# EAGLE design ns_V2 (EAGLE 5.09)
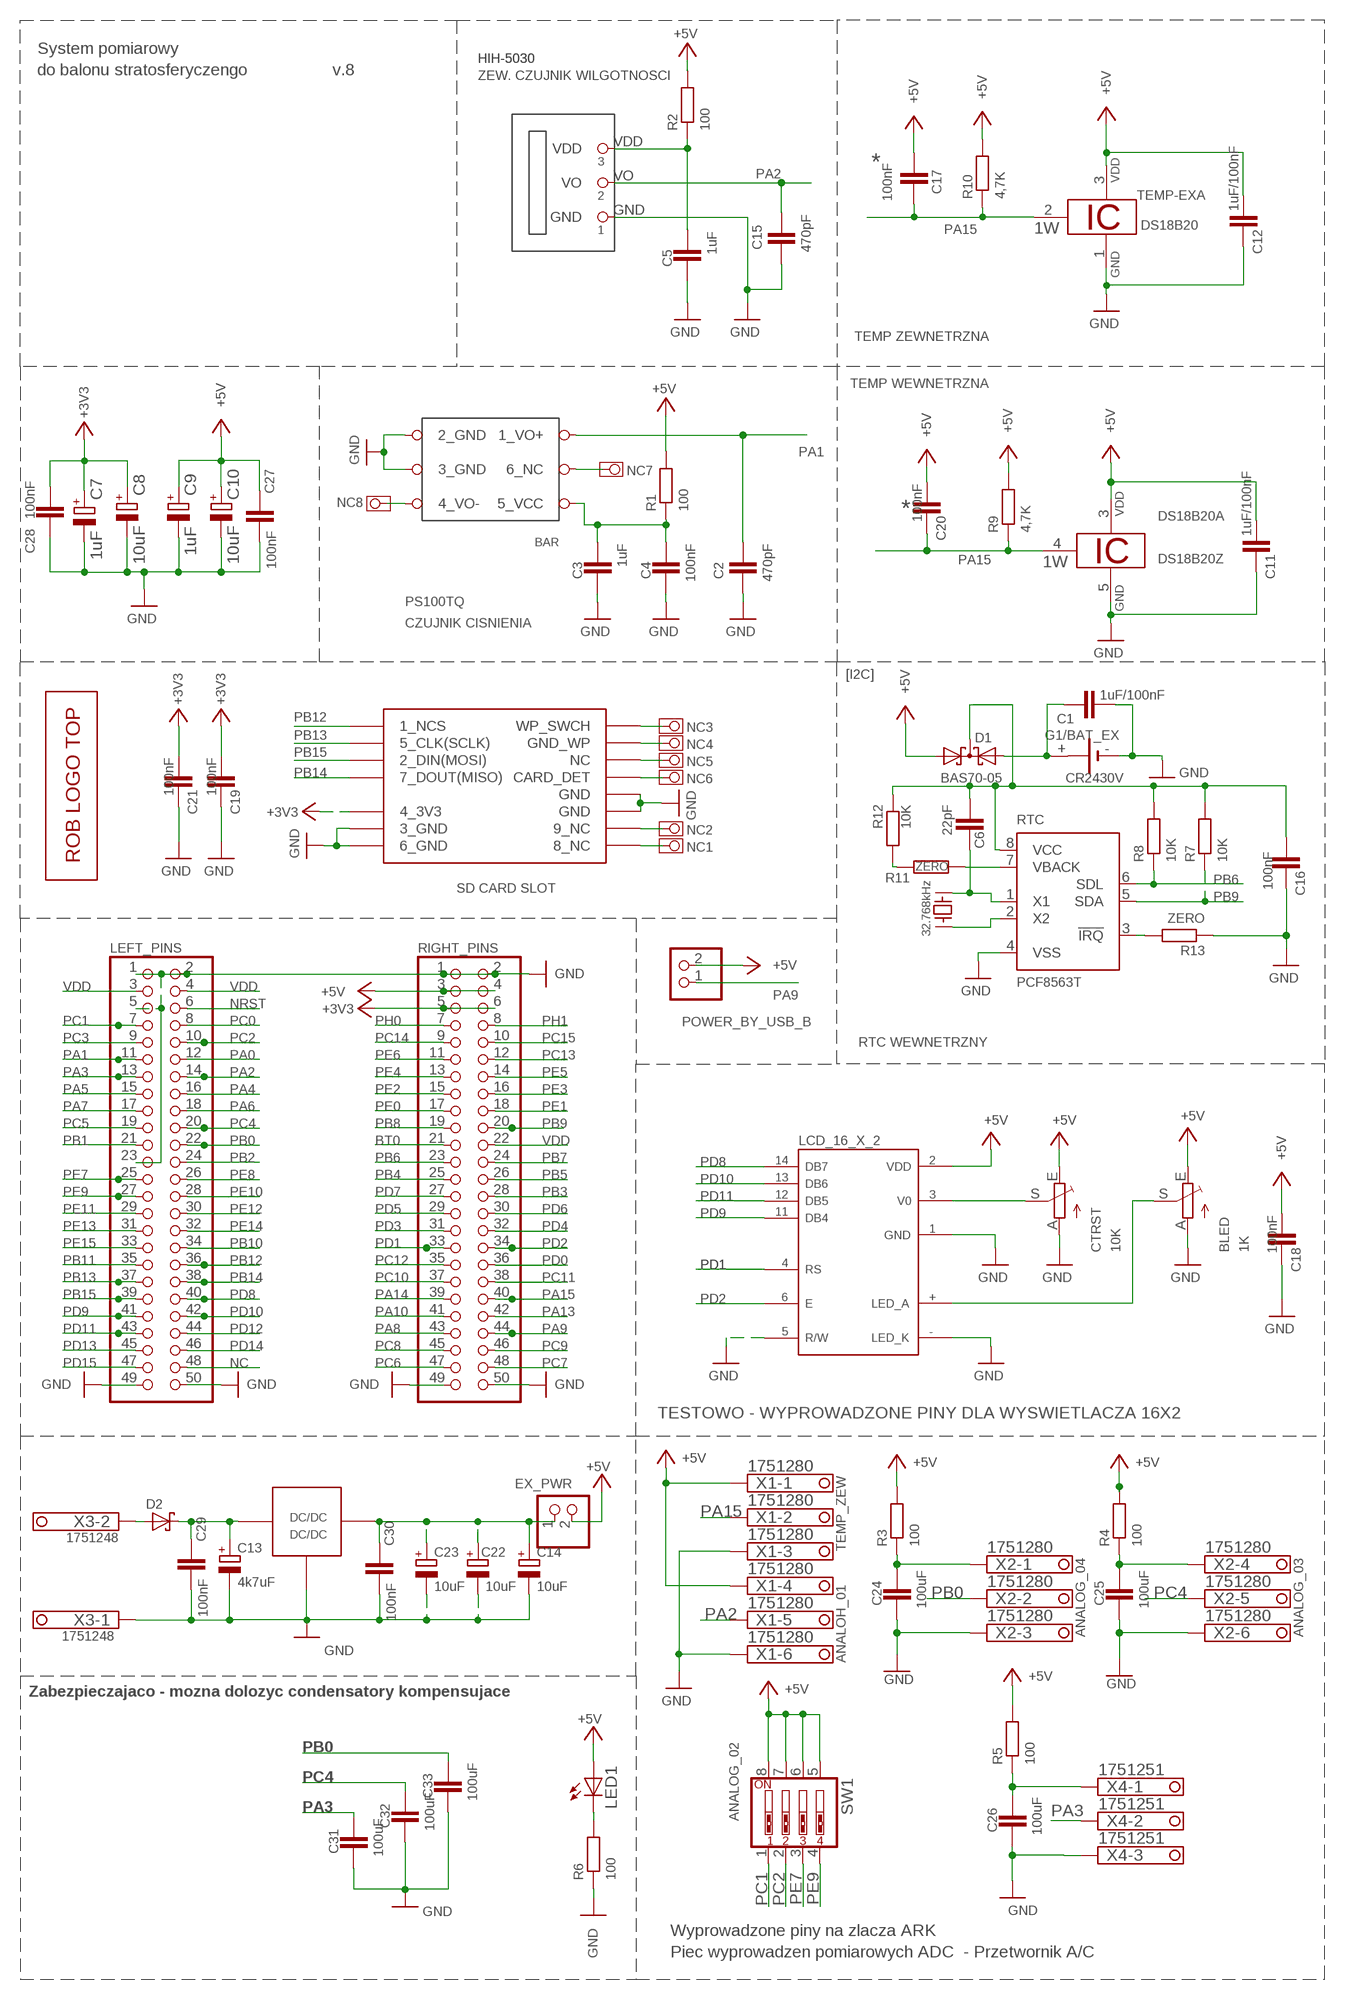
[diagram p0: schematic, sheet 1]

## Parts
BLED  1K  TRIM_EU-B25P  [B25P]
C1  1uF/100nF  C-EUC1206K  [C1206K]
C2  470pF  C-EUC1206  [C1206]
C3  1uF  C-EUC1206  [C1206]
C4  100nF  C-EUC1206  [C1206]
C5  1uF  C-EUC1206  [C1206]
C6  22pF  C-EUC1206  [C1206]
C7  1uF  CPOL-EU153CLV-0505  [153CLV-0505]
C8  10uF  CPOL-EU153CLV-0505  [153CLV-0505]
C9  1uF  CPOL-EU153CLV-0505  [153CLV-0505]
C10  10uF  CPOL-EU153CLV-0505  [153CLV-0505]
C11  1uF/100nF  C-EUC1206  [C1206]
C12  1uF/100nF  C-EUC1206  [C1206]
C13  4k7uF  CPOL-EU153CLV-0505  [153CLV-0505]
C14  10uF  CPOL-EU153CLV-0505  [153CLV-0505]
C15  470pF  C-EUC1206  [C1206]
C16  100nF  C-EUC1206  [C1206]
C17  100nF  C-EUC1206  [C1206]
C18  100nF  C-EUC1206  [C1206]
C19  100nF  C-EUC1206  [C1206]
C20  100nF  C-EUC1206  [C1206]
C21  100nF  C-EUC1206  [C1206]
C22  10uF  CPOL-EU153CLV-0505  [153CLV-0505]
C23  10uF  CPOL-EU153CLV-0505  [153CLV-0505]
C24  100uF  C-EUC1206  [C1206]
C25  100uF  C-EUC1206  [C1206]
C26  100uF  C-EUC1206  [C1206]
C27  100nF  C-EUC1206  [C1206]
C28  100nF  C-EUC1206  [C1206]
C29  100nF  C-EUC1206  [C1206]
C30  100nF  C-EUC1206  [C1206]
C31  100uF  C-EUC1206  [C1206]
C32  100uF  C-EUC1206  [C1206]
C33  100uF  C-EUC1206  [C1206]
CTRST  10K  TRIM_EU-B25P  [B25P]
D1  BAS70-05  [SOT23]
D2  MBRS130LT3  [SMB]
DS18B20  DS18B20Z  [SO08]
EX_PWR  PINHD-1X2  [1X02]
G1/BAT_EX  CR2430V  [CR2430V]
LCD_16_X_2  PYC0802A  [PYC0802A-ONLY-PINS]
LED1  LEDCHIPLED_1206  [CHIPLED_1206]
LEFT_PINS  PINHD-2X25  [2X25]
NC1  SMD_1X1  [SMD_1X1]
NC2  SMD_1X1  [SMD_1X1]
NC3  SMD_1X1  [SMD_1X1]
NC4  SMD_1X1  [SMD_1X1]
NC5  SMD_1X1  [SMD_1X1]
NC6  SMD_1X1  [SMD_1X1]
NC7  SMD_1X1  [SMD_1X1]
NC8  SMD_1X1  [SMD_1X1]
POWER_BY_USB_B  PINHD-1X2  [1X02]
R1  100  R-EU_R1206  [R1206]
R2  100  R-EU_R1206  [R1206]
R3  100  R-EU_R1206  [R1206]
R4  100  R-EU_R1206  [R1206]
R5  100  R-EU_R1206  [R1206]
R6  100  R-EU_R1206  [R1206]
R7  10K  R-EU_R1206  [R1206]
R8  10K  R-EU_R1206  [R1206]
R9  4,7K  R-EU_R1206  [R1206]
R10  4,7K  R-EU_R1206  [R1206]
R11  ZERO  R-EU_R1206  [R1206]
R12  10K  R-EU_R1206  [R1206]
R13  ZERO  R-EU_R1206  [R1206]
RIGHT_PINS  PINHD-2X25  [2X25]
RTC  PCF8563T  X1205S8  [SO-08]
SW1  SW_DIP-4  [EDG-04]
TEMP-EX  DS18B20  [TO92-]
U$1  MMC  [MMC_SOCKET]
U$2  XTAL-SMD-MC-146  [XTAL-SMD-MC-146]
U$3  PS100TQ  [PS100TQ]
U$4  HIH5030-CZUJ-WILG  [HIH-5030-CZUJ-WILG]
U$6  PRZETW-RECOM-R785  [PRZETW-RECOM-R785]
U$7  ROB-LOGO  [ROB-LOGO-TOP]
X1  1751280  [1751280]
X2  1751280  [1751280]
X3  1751248  [1751248]
X4  1751251  [1751251]

## Nets
5_WEW_PS100: C3.2 C4.2 R1.1 U$3.VCC(5_VCC)
9V: D2.A X3.2
9V_D: C13.+ C29.2 D2.C U$6.DC_IN
32_7_X1: C6.1 RTC.1(X1) U$2.P$3
32_7_X2: RTC.2(X2) U$2.P$1
+3V3: C7.+ C8.+ C19.2 C21.2 C28.2 RIGHT_PINS.5 RIGHT_PINS.6 U$1.4_3V3
+5_RTC: C6.2 C16.2 D1.3(C) R7.2 R8.2 R12.2 RTC.8(VCC)
+5V: BLED.E C9.+ C10.+ C11.2 C12.2 C17.2 C18.2 C20.2 C27.2 CTRST.E D1.1(A1) DS18B20.3 EX_PWR.2 LCD_16_X_2.2 LED1.A POWER_BY_USB_B.2 R1.2 R2.2 R3.2 R4.2 R5.2 R9.2 R10.2 RIGHT_PINS.3 RIGHT_PINS.4 SW1.5 SW1.6 SW1.7 SW1.8 TEMP-EX.3 X1.1 X1.4
BT0: RIGHT_PINS.21
GND: BLED.A C1.2 C2.1 C3.1 C4.1 C5.1 C7.- C8.- C9.- C10.- C11.1 C12.1 C13.- C14.- C15.1 C16.1 C18.1 C19.1 C21.1 C22.- C23.- C24.1 C25.1 C26.1 C27.1 C28.1 C29.1 C30.1 C31.1 C32.1 C33.1 CTRST.A DS18B20.5 G1/BAT_EX.- LCD_16_X_2.1 LCD_16_X_2.5 LCD_16_X_2.LED_K LEFT_PINS.1 LEFT_PINS.2 LEFT_PINS.5 LEFT_PINS.23 LEFT_PINS.49 LEFT_PINS.50 R6.1 R13.1 RIGHT_PINS.1 RIGHT_PINS.2 RIGHT_PINS.49 RIGHT_PINS.50 RTC.4(VSS) TEMP-EX.1 U$1.3_GND@1(3_GND) U$1.6_GND@2(6_GND) U$1.GND@3(GND) U$1.GND@4(GND) U$3.GND1(2_GND) U$3.GND2(3_GND) U$4.GND U$6.DC_GND X1.3 X1.6 X2.3 X2.6 X3.1 X4.3
LCD_LED_A: BLED.S LCD_16_X_2.LED_A
LCD_V0: CTRST.S LCD_16_X_2.3
N$1: NC7.P$1 U$3.NC(6_NC)
N$2: NC3.P$1 U$1.WRITE_PROTECTION_SWITCH(WP_SWCH)
N$3: NC8.P$1 U$3.V0-(4_VO-)
N$4: NC4.P$1 U$1.GND@WP(GND_WP)
N$6: NC5.P$1 U$1.NC@3(NC)
N$7: NC6.P$1 U$1.CARD_DETECTION(CARD_DET)
N$8: NC1.P$1 U$1.8_NC@2(8_NC)
N$9: NC2.P$1 U$1.9_NC@1(9_NC)
N$11: R11.1 RTC.7(VBACK)
N$12: C1.1 D1.2(A2) G1/BAT_EX.+
N$13: C5.2 R2.1 U$4.VDD
N$15: C24.2 R3.1 X2.1
N$16: C25.2 R4.1 X2.4
N$17: LED1.C R6.2
N$18: C26.2 R5.1 X4.1
N$19: R11.2 R12.1
N$28: R13.2 RTC.3(!IRQ)
NC: LEFT_PINS.48
NRST: LEFT_PINS.6
PA0: LEFT_PINS.12
PA1: C2.2 LEFT_PINS.11 U$3.VO+(1_VO+)
PA2: C15.2 LEFT_PINS.14 U$4.VO X1.5
PA3: C31.2 LEFT_PINS.13 X4.2
PA4: LEFT_PINS.16
PA5: LEFT_PINS.15
PA6: LEFT_PINS.18
PA7: LEFT_PINS.17
PA8: RIGHT_PINS.43
PA9: POWER_BY_USB_B.1 RIGHT_PINS.44
PA10: RIGHT_PINS.41
PA13: RIGHT_PINS.42
PA14: RIGHT_PINS.39
PA15: C17.1 C20.1 DS18B20.4 R9.1 R10.1 RIGHT_PINS.40 TEMP-EX.2 X1.2
PB0: C33.2 LEFT_PINS.22 X2.2
PB1: LEFT_PINS.21
PB2: LEFT_PINS.24
PB3: RIGHT_PINS.28
PB4: RIGHT_PINS.25
PB5: RIGHT_PINS.26
PB6: R8.1 RIGHT_PINS.23 RTC.6(SDL)
PB7: RIGHT_PINS.24
PB8: RIGHT_PINS.19
PB9: R7.1 RIGHT_PINS.20 RTC.5(SDA)
PB10: LEFT_PINS.34
PB11: LEFT_PINS.35
PB12: LEFT_PINS.36 U$1.1_NCS
PB13: LEFT_PINS.37 U$1.5_CLK(SCLK)
PB14: LEFT_PINS.38 U$1.7_DOUT(MISO)
PB15: LEFT_PINS.39 U$1.2_DIN(MOSI)
PC0: LEFT_PINS.8
PC1: LEFT_PINS.7 SW1.1
PC2: LEFT_PINS.10 SW1.2
PC3: LEFT_PINS.9
PC4: C32.2 LEFT_PINS.20 X2.5
PC5: LEFT_PINS.19
PC6: RIGHT_PINS.47
PC7: RIGHT_PINS.48
PC8: RIGHT_PINS.45
PC9: RIGHT_PINS.46
PC10: RIGHT_PINS.37
PC11: RIGHT_PINS.38
PC12: RIGHT_PINS.35
PC13: RIGHT_PINS.12
PC14: RIGHT_PINS.9
PC15: RIGHT_PINS.10
PD0: RIGHT_PINS.36
PD1: LCD_16_X_2.4 RIGHT_PINS.33
PD2: LCD_16_X_2.6 RIGHT_PINS.34
PD3: RIGHT_PINS.31
PD4: RIGHT_PINS.32
PD5: RIGHT_PINS.29
PD6: RIGHT_PINS.30
PD7: RIGHT_PINS.27
PD8: LCD_16_X_2.14 LEFT_PINS.40
PD9: LCD_16_X_2.11 LEFT_PINS.41
PD10: LCD_16_X_2.13 LEFT_PINS.42
PD11: LCD_16_X_2.12 LEFT_PINS.43
PD12: LEFT_PINS.44
PD13: LEFT_PINS.45
PD14: LEFT_PINS.46
PD15: LEFT_PINS.47
PE0: RIGHT_PINS.17
PE1: RIGHT_PINS.18
PE2: RIGHT_PINS.15
PE3: RIGHT_PINS.16
PE4: RIGHT_PINS.13
PE5: RIGHT_PINS.14
PE6: RIGHT_PINS.11
PE7: LEFT_PINS.25 SW1.3
PE8: LEFT_PINS.26
PE9: LEFT_PINS.27 SW1.4
PE10: LEFT_PINS.28
PE11: LEFT_PINS.29
PE12: LEFT_PINS.30
PE13: LEFT_PINS.31
PE14: LEFT_PINS.32
PE15: LEFT_PINS.33
PH0: RIGHT_PINS.7
PH1: RIGHT_PINS.8
PLUS_5: C14.+ C22.+ C23.+ C30.2 EX_PWR.1 U$6.DC_OUT
VDD: LEFT_PINS.3 LEFT_PINS.4 RIGHT_PINS.22
Unconnected: G1/BAT_EX.+@1(+)

## Notes on the sheet
- System pomiarowy
- HIH-5030 | HIH-5030
- do balonu stratosferyczengo | v.8
- ZEW. CZUJNIK WILGOTNOSCI
- *
- TEMP ZEWNETRZNA
- TEMP WEWNETRZNA
- *
- PS100TQ
- CZUJNIK CISNIENIA
- [I2C]
- SD CARD SLOT
- RTC WEWNETRZNY
- TESTOWO - WYPROWADZONE PINY DLA WYSWIETLACZA 16X2
- TEMP_ZEW
- ANALOG_04 | ANALOG_03
- ANALOH_01
- Zabezpieczajaco - mozna dolozyc condensatory kompensujace
- ANALOG_02
- Wyprowadzone piny na zlacza ARK
- Piec wyprowadzen pomiarowych ADC  - Przetwornik A/C

## Library data of the parts
BLED CTRST = pot:TRIM_EU-: POTENTIOMETER
C1-C6 C11 C12 C15-C21 C24-C33 = rcl:C-EU: CAPACITOR, European symbol
C7-C10 C13 C14 C22 C23 = rcl:CPOL-EU: POLARIZED CAPACITOR, European symbol
D1 = diode:BAS70-05: Silicon Schottky Diodes General-purpose diode for high-speed switching
D2 = diode:MBRS130LT3: Schottky Power Rectifier Source: http://www.onsemi.com/pub/Collateral/MBRS130LT3-D.PDF
DS18B20 TEMP-EX = ds18b20:DS18B20: Programmable Resolution Digital Thermometer This chip provides a onewire thermosensor with approx. 0.5°C accuracy. A programmable over/undertemperure alarm is available. The precision can be set from 9..12 bits. Notes: Vdd must be applied for accurate measurements at low temperatures, as the parasite power circuit otherwise heats the sensor. If parasite power is used, Vdd has to be connected to GND. The DS1822 is a low-cost thermometer chip, the DS18S20 is similar to the DS18B20, but with 9 Bit precision only. Author: Jan Kandziora <jjj@gmx.de>
EX_PWR POWER_BY_USB_B = pinhead:PINHD-1X2: PIN HEADER
G1/BAT_EX = battery:CR2430V: LI BATTERY Varta
LCD_16_X_2 = PYC0802:PYC0802A
LED1 = led:LED: LED OSRAM: - CHIPLED LG R971, LG N971, LY N971, LG Q971, LY Q971, LO R971, LY R971 LH N974, LH R974 LS Q976, LO Q976, LY Q976 LO Q996 - Hyper CHIPLED LW Q18S LB Q993, LB Q99A, LB R99A - SideLED LS A670, LO A670, LY A670, LG A670, LP A670 LB A673, LV A673, LT A673, LW A673 LH A674 LY A675 LS A676, LA A676, LO A676, LY A676, LW A676 LS A679, LY A679, LG A679 - Hyper Micro SIDELED® LS Y876, LA Y876, LO Y876, LY Y876 LT Y87S - SmartLED LW L88C, LW L88S LB L89C, LB L89S, LG L890 LS L89K, LO L89K, LY L89K LS L896, LA L896, LO L896, LY L896 - TOPLED LS T670, LO T670, LY T670, LG T670, LP T670 LSG T670, LSP T670, LSY T670, LOP T670, LYG T670 LG T671, LOG T671, LSG T671 LB T673, LV T673, LT T673, LW T673 LH T674 LS T676, LA T676, LO T676, LY T676, LB T676, LH T676, LSB T676, LW T676 LB T67C, LV T67C, LT T67C, LS T67K, LO T67K, LY T67K, LW E67C LS E67B, LA E67B, LO E67B, LY E67B, LB E67C, LV E67C, LT E67C LW T67C LS T679, LY T679, LG T679 LS T770, LO T770, LY T770, LG T770, LP T770 LB T773, LV T773, LT T773, LW T773 LH T774 LS E675, LA E675, LY E675, LS T675 LS T776, LA T776, LO T776, LY T776, LB T776 LHGB T686 LT T68C, LB T68C - Hyper Mini TOPLED® LB M676 - Mini TOPLED Santana® LG M470 LS M47K, LO M47K, LY M47K Source: http://www.osram.convergy.de LUXEON: - LUMILED® LXK2-PW12-R00, LXK2-PW12-S00, LXK2-PW14-U00, LXK2-PW14-V00 LXK2-PM12-R00, LXK2-PM12-S00, LXK2-PM14-U00 LXK2-PE12-Q00, LXK2-PE12-R00, LXK2-PE12-S00, LXK2-PE14-T00, LXK2-PE14-U00 LXK2-PB12-K00, LXK2-PB12-L00, LXK2-PB12-M00, LXK2-PB14-N00, LXK2-PB14-P00, LXK2-PB14-Q00 LXK2-PR12-L00, LXK2-PR12-M00, LXK2-PR14-Q00, LXK2-PR14-R00 LXK2-PD12-Q00, LXK2-PD12-R00, LXK2-PD12-S00 LXK2-PH12-R00, LXK2-PH12-S00 LXK2-PL12-P00, LXK2-PL12-Q00, LXK2-PL12-R00 Source: www.luxeon.com KINGBRIGHT: KA-3528ASYC Source: www.kingbright.com
LEFT_PINS RIGHT_PINS = pinhead:PINHD-2X25: PIN HEADER
NC1-NC8 = pinhead:SMD_1X1
R1-R13 = rcl:R-EU_: RESISTOR, European symbol
RTC = xicor:X1205*: 2-Wire RTC Real Time Clock/Calendar
SW1 = special:SW_DIP-4: DIP SWITCH
U$1 = SD:MMC
U$2 = rob:XTAL-SMD-MC-146
U$3 = rob:PS100TQ
U$4 = rob:HIH5030-CZUJ-WILG
U$6 = rob:PRZETW-RECOM-R785
U$7 = rob:ROB-LOGO
X1 X2 = con-phoenix-350:1751280: MKDS 1/ 6-3,5 Printklemme Nennstrom: 10 A Bemessungsspannung: 160 V Raster: 3,5 mm Polzahl: 6 Montageart: Löten Anschlussart: Schraubanschluss Anschlussrichtung vom Leiter zur Platine: 0° Source: http://eshop.phoenixcontact.com .. 1751280.pdf
X3 = con-phoenix-350:1751248: MKDS 1/ 2-3,5 Printklemme Nennstrom: 10 A Bemessungsspannung: 160 V Raster: 3,5 mm Polzahl: 2 Montageart: Löten Anschlussart: Schraubanschluss Anschlussrichtung vom Leiter zur Platine: 0° Source: http://eshop.phoenixcontact.com .. 1751248.pdf
X4 = con-phoenix-350:1751251: MKDS 1/ 3-3,5 Printklemme Nennstrom: 10 A Bemessungsspannung: 160 V Raster: 3,5 mm Polzahl: 3 Montageart: Löten Anschlussart: Schraubanschluss Anschlussrichtung vom Leiter zur Platine: 0° Source: http://eshop.phoenixcontact.com .. 1751251.pdf

## Board
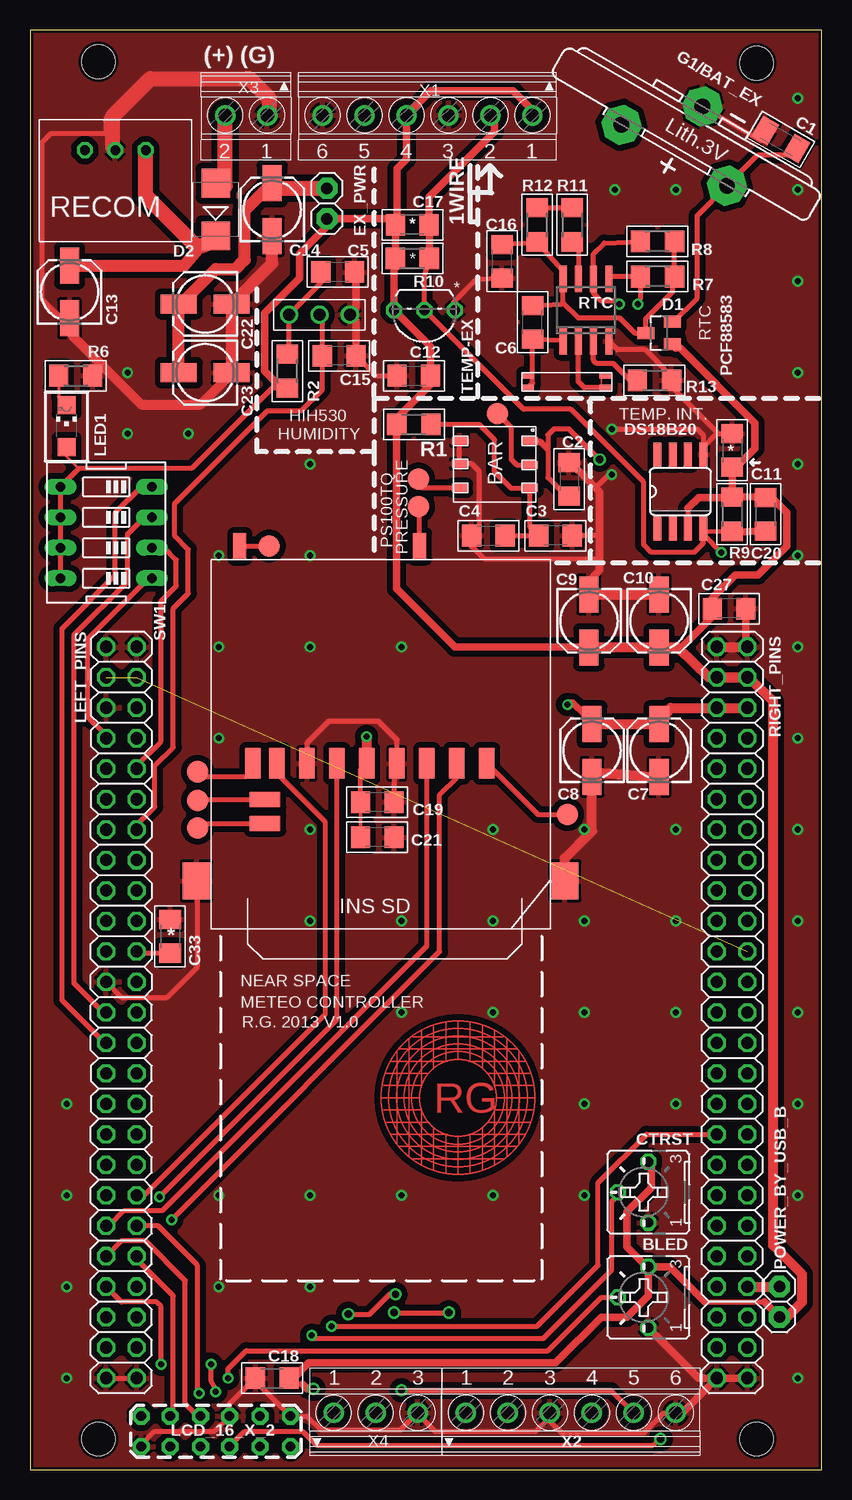
[diagram p1: board, top side]
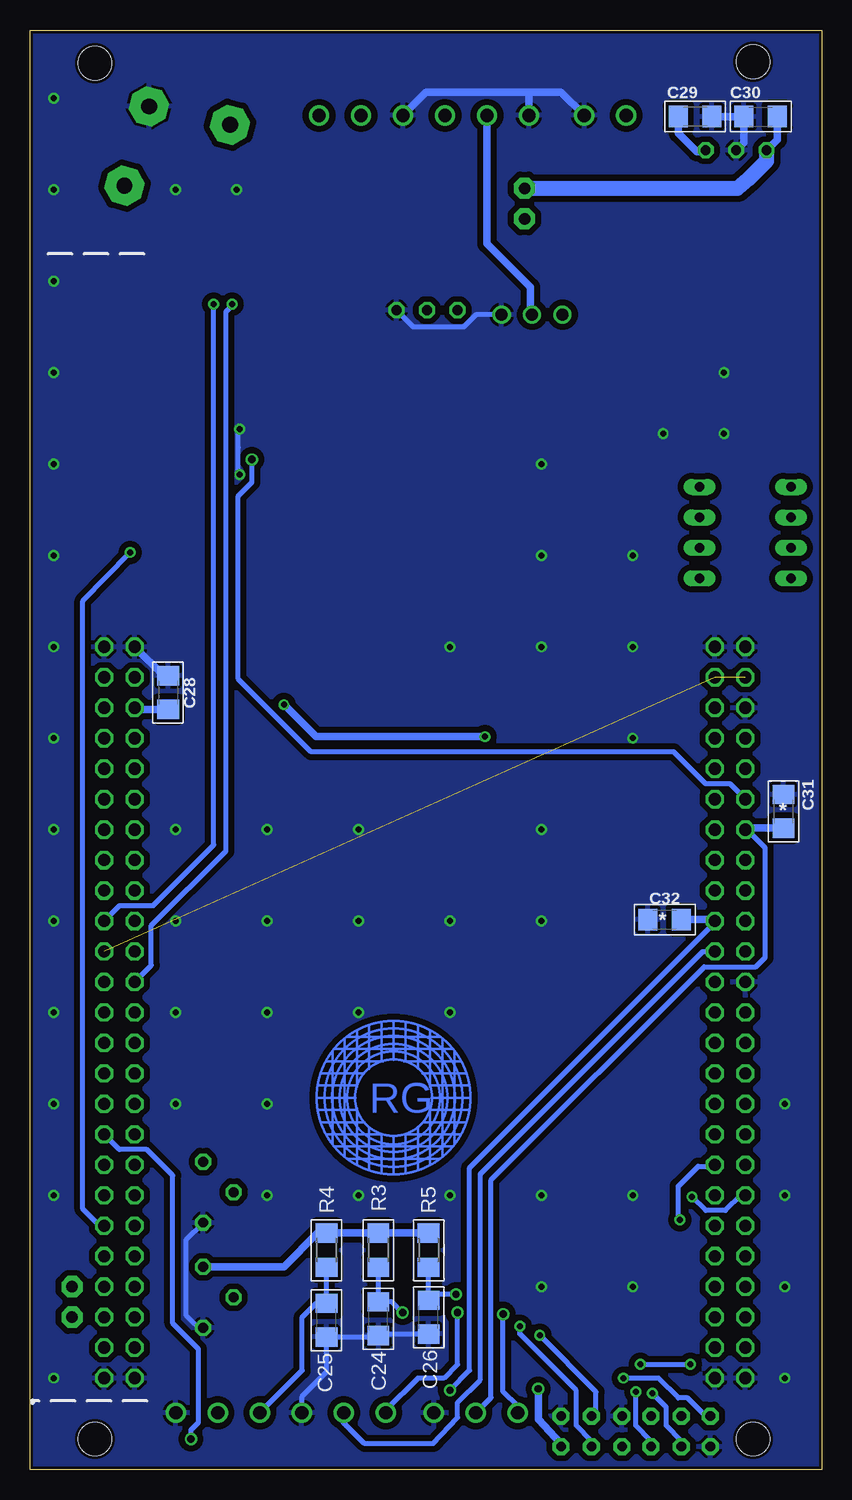
[diagram p2: board, bottom side, seen from below]

Size 66 x 120 mm. Coordinates in mm from the lower left corner, seen from the top.
Outline: 0,0 66,0 66,120 0,120 0,0
Copper layers (1*16): Top 0.035mm / dielectric 3mm / Bottom 0.035mm
Design rules "default *": minimum track width 10mil, minimum drill 24mil, track to track 20mil, track to pad 20mil, pad to pad 20mil, via to via 20mil, smd to smd 20mil, copper to edge 10mil, drill to drill 20mil, minimum pad ring 10mil, minimum via ring 8mil, stop-mask expansion 4mil, vias tented up to drill 0mil, thermal gap 10mil
Holes 2.8 mm at 5.71,117.35 60.58,117.22 60.58,2.54 5.71,2.54

### Footprints (pad centres in the part's own frame; a part is rotated, then mirrored left to right if it is on the bottom)
B25P = drill 0.813 octagon: A -2.54,0; E 2.54,0; S 0,2.54
C1206K = smd 1.5 x 2: 1 -1.5,0; 2 1.5,0
C1206 = smd 1.6 x 1.8: 1 -1.4,0; 2 1.4,0
153CLV-0505 = smd 3 x 1.6: + 2.2,0; - -2.2,0
SOT23 = smd 1 x 1.4: 1 -0.95,-1.1; 2 0.95,-1.1; 3 0,1.1
SMB = smd 2.4 x 2.4: A 2.2,0; C -2.2,0
SO08 = smd 0.66 x 2.032: 1 -1.905,-3.073; 2 -0.635,-3.073; 3 0.635,-3.073; 4 1.905,-3.073; 5 1.905,3.073; 6 0.635,3.073; 7 -0.635,3.073; 8 -1.905,3.073
1X02 = drill 0.965 pad 1.778 octagon: 1 -1.27,0; 2 1.27,0
CR2430V = drill 1.321 pad 3.15 octagon: + -2.54,-5.08; +@1 -2.54,5.08; - 2.159,0
PYC0802A-ONLY-PINS = drill 0.8 pad 1.422 octagon: 1 2.54,0; 2 0,0; 3 2.54,2.54; 4 0,2.54; 5 2.54,5.08; 6 0,5.08; 11 2.54,7.493; 12 0,7.493; 13 2.54,10.033; 14 0,10.033; LED_A 2.54,12.446; LED_K 0,12.446
CHIPLED_1206 = smd 1.5 x 1.5: A 0,-1.75; C 0,1.75
2X25 = drill 1.016 octagon: 1 -30.48,-1.27; 2 -30.48,1.27; 3 -27.94,-1.27; 4 -27.94,1.27; 5 -25.4,-1.27; 6 -25.4,1.27; 7 -22.86,-1.27; 8 -22.86,1.27; 9 -20.32,-1.27; 10 -20.32,1.27; 11 -17.78,-1.27; 12 -17.78,1.27; 13 -15.24,-1.27; 14 -15.24,1.27; 15 -12.7,-1.27; 16 -12.7,1.27; 17 -10.16,-1.27; 18 -10.16,1.27; 19 -7.62,-1.27; 20 -7.62,1.27; 21 -5.08,-1.27; 22 -5.08,1.27; 23 -2.54,-1.27; 24 -2.54,1.27; 25 0,-1.27; 26 0,1.27; 27 2.54,-1.27; 28 2.54,1.27; 29 5.08,-1.27; 30 5.08,1.27; 31 7.62,-1.27; 32 7.62,1.27; 33 10.16,-1.27; 34 10.16,1.27; 35 12.7,-1.27; 36 12.7,1.27; 37 15.24,-1.27; 38 15.24,1.27; 39 17.78,-1.27; 40 17.78,1.27; 41 20.32,-1.27; 42 20.32,1.27; 43 22.86,-1.27; 44 22.86,1.27; 45 25.4,-1.27; 46 25.4,1.27; 47 27.94,-1.27; 48 27.94,1.27; 49 30.48,-1.27; 50 30.48,1.27
SMD_1X1 = smd 1.778 x 1.778: P$1 0,0
R1206 = smd 1.6 x 1.803: 1 -1.422,0; 2 1.422,0
SO-08 = smd 0.6 x 2.2: 1 -1.905,-2.6; 2 -0.635,-2.6; 3 0.635,-2.6; 4 1.905,-2.6; 5 1.905,2.6; 6 0.635,2.6; 7 -0.635,2.6; 8 -1.905,2.6
EDG-04 = drill 0.813 long: 1 -3.81,-3.81; 2 -1.27,-3.81; 3 1.27,-3.81; 4 3.81,-3.81; 5 3.81,3.81; 6 1.27,3.81; 7 -1.27,3.81; 8 -3.81,3.81
TO92- = drill 0.813 octagon: 1 -2.54,0; 2 0,0; 3 2.54,0
MMC_SOCKET = smd 1.27 x 2.54: 1_NCS 7.27,-2.73; 2_DIN(MOSI) 4.77,-2.73; 3_GND@1 2.27,-2.73; 4_3V3 -0.23,-2.73; 5_CLK(SCLK) -2.73,-2.73; 6_GND@2 -5.23,-2.73; 7_DOUT(MISO) -7.73,-2.73; 8_NC@2 -9.73,-2.73; 9_NC@1 9.77,-2.73 | smd 1.067 x 2.184: CARD_DETECTION -10.83,15.37; NC@3 4.17,15.37 | smd 2.3 x 3.1: GND@3 -14.43,-12.53; GND@4 16.27,-12.53 | smd 2.54 x 1.27: GND@WP -8.73,-5.73; WRITE_PROTECTION_SWITCH -8.73,-7.73
XTAL-SMD-MC-146 = smd 1.016 x 0.508: P$1 0.508,1.27; P$2 0.508,0.254; P$3 6.985,1.27; P$4 6.985,0.254
PS100TQ = smd 1.27 x 0.66: GND1 0.5,5.1; GND2 0.5,3.2; NC 6.4,3.1; V0- 0.5,1.2; VCC 6.4,1.2; VO+ 6.4,5.1
HIH-5030-CZUJ-WILG = drill 1 pad 1.27 round: GND 1.27,0; VDD -3.81,0; VO -1.27,0
PRZETW-RECOM-R785 = drill 0.8 octagon: DC_GND 2.54,0; DC_IN 0,0; DC_OUT 5.08,0
1751280 = drill 1.1 pad 1.7 round: 1 -8.75,-0.1; 2 -5.25,-0.1; 3 -1.75,-0.1; 4 1.75,-0.1; 5 5.25,-0.1; 6 8.75,-0.1
1751248 = drill 1.1 pad 1.7 round: 1 -1.75,-0.1; 2 1.75,-0.1
1751251 = drill 1.1 pad 1.7 round: 1 -3.5,-0.1; 2 0,-0.1; 3 3.5,-0.1

### Placement (x,y rotation side)
BLED  51.56,14.35 90 top
C1  62.61,110.87 150 top
C2  44.96,82.55 270 top
C3  43.81,77.85 180 top
C4  38.23,77.85 0 top
C5  25.65,99.82 180 top
C6  41.91,95.63 90 top
C7  52.45,59.94 90 top
C8  46.86,59.94 90 top
C9  46.61,70.74 270 top
C10  52.45,70.74 270 top
C11  58.55,84.96 270 top
C12  32,91.19 0 top
C13  3.3,98.17 90 top
C14  20.19,105.03 90 top
C15  25.78,92.84 180 top
C16  39.37,100.71 90 top
C17  31.88,103.76 180 top
C18  20.19,7.62 0 top
C19  28.96,55.63 180 top
C20  61.34,79.63 90 top
C21  28.96,52.7 180 top
C22  14.61,97.16 180 top
C23  14.61,91.44 180 top
C24  36.96,12.57 90 bottom
C25  41.27,12.45 90 bottom
C26  32.77,12.7 90 bottom
C27  58.29,71.75 180 top
C28  54.48,64.77 270 bottom
C29  10.54,112.78 180 bottom
C30  5.08,112.78 0 bottom
C31  3.17,54.86 270 bottom
C32  13.08,45.85 0 bottom
C33  11.68,44.45 270 top
CTRST  51.56,23.11 90 top
D1  52.45,94.74 90 top
D2  15.49,105.03 90 top
DS18B20  54.23,81.53 0 top
EX_PWR  24.77,105.54 270 top
G1/BAT_EX  54.99,111.76 60 top
LCD_16_X_2  21.72,1.91 90 top
LED1  3.05,87 0 top
LEFT_PINS  7.62,38.1 270 top
NC1  13.97,58.17 0 top
NC2  44.83,54.61 0 top
NC3  13.97,53.47 0 top
NC4  13.97,55.75 0 top
NC5  32.38,80.26 0 top
NC6  19.94,76.96 0 top
NC7  38.99,88.01 0 top
NC8  32.38,82.55 0 top
POWER_BY_USB_B  62.48,13.97 270 top
R1  32,87.12 180 top
R2  21.46,91.57 270 top
R3  36.96,18.29 90 bottom
R4  41.27,18.29 90 bottom
R5  32.77,18.29 90 bottom
R6  3.81,91.19 180 top
R7  52.32,99.44 0 top
R8  52.32,102.36 0 top
R9  58.55,79.63 90 top
R10  31.88,100.97 180 top
R11  45.21,103.76 90 top
R12  42.29,103.76 270 top
R13  52.07,90.81 180 top
RIGHT_PINS  58.55,38.1 270 top
RTC  46.35,96.65 0 top
SW1  6.35,78.11 90 top
TEMP-EX  32.89,96.65 180 top
U$1  28.32,61.59 0 top
U$2  48.51,91.44 180 top
U$3  35.31,80.64 0 top
U$4  25.4,96.27 0 top
U$5  ROB-LOGO  [ROB-LOGO-TOP@1]  35.69,30.99 0 top
U$6  9.65,109.98 180 top
U$7  35.69,30.99 0 bottom
X1  33.15,112.78 180 top
X2  45.09,4.83 0 top
X3  18.03,112.78 180 top
X4  28.83,4.83 0 top

### Tracks (layer width: path | path; a pad name or v marks a point on that pad's centre or on a via)
5_WEW_PS100
  Top 0.406: R1.1 37.47,87.12 38.73,85.85 38.73,83.19 40.13,81.79 41.65,81.79 U$3.VCC 41.71,78.56 C3.2 C4.2
9V
  Top 1.27: X3.2 16.28,107 D2.A
9V_D
  Top 1.016: C13.+ 12.87,100.37 14.22,101.98
  Top 1.27: U$6.DC_IN 9.65,106.17 13.84,101.98 14.22,101.98 15.41,102.49 D2.C
  Bottom 0.61: C29.2 11.94,111.38 10.41,109.86 9.78,109.86 U$6.DC_IN
32_7_X1
  Top 0.406: RTC.1 44.37,94.13 C6.1 41.91,90.55 U$2.P$3
32_7_X2
  Top 0.406: RTC.2 45.72,90.68 46.23,90.17 U$2.P$1
+3V3  (via drill 0.5)
  Top 0.305: C21.2 C19.2
  Top 0.406: C19.2 27.58,58.36 U$1.4_3V3
  Top 0.61: 28.09,61.06 v28.07,61.09 | v44.83,63.75 44.83,63.88 45.21,63.88 45.34,63.75 46.1,63.16 C8.+
  Top 0.813: RIGHT_PINS.6 RIGHT_PINS.5 53.43,63.5 C7.+ C8.+ | U$1.4_3V3 28.09,61.06
  Bottom 0.61: v28.07,61.09 42.16,61.09 v44.83,63.75 | C28.2 57.15,63.37 RIGHT_PINS.5
+5_RTC
  Top 0.406: R8.2 R7.2 53.59,99.31 53.59,98.17 51.35,95.93 D1.3 50.42,94.74 49.15,96.01 45.72,96.01 44.45,97.28 | C16.2 41.91,102.21 R12.2 44.45,99.92 RTC.8 44.45,97.28 | C6.2 44.3,97.13 44.45,97.28
+5V  (via drill 0.6)
  Top 0.254: LED1.A 3.05,84.45 4.06,83.44
  Top 0.406: 58.55,80.9 R9.2 58.54,81.03 58.04,81.03 | 54.86,80.14 DS18B20.3 54.86,77.85 | C11.2 58.7,83.34 | 54.23,93.47 53.87,93.47 | BLED.E 51.69,16.89 | 52.45,68.83 52.7,68.83 | 29.97,104.27 C17.2 | SW1.8 SW1.7 SW1.6 SW1.5 4.06,83.44 13.46,83.44 20.17,90.14 R2.2 20.98,90.14 | 30.58,87.61 R1.2 | 33.53,90.55 33.53,91.06 C12.2 | 24.64,103.5 24.64,104.14 EX_PWR.2 | 21.97,7.62 C18.2 22.1,7.11 22.73,7.11 | 56.26,13.97 61.21,13.97
  Top 0.61: 58.55,80.9 C11.2 | 30.35,104.27 29.97,104.27 | 30.35,104.27 30.61,104.52 30.61,108.46 31.4,109.25 X1.4 33.46,114.94 40.26,114.94 41.9,113.3 X1.1 | 54.86,80.14 55.75,81.03 58.04,81.03 58.52,81.13 C20.2 61.72,81.15 63.12,79.76 63.12,76.96 60.71,74.55 58.8,74.55 56.89,72.64 C27.2 56.89,71.1 54.18,68.39 54.17,68.39 54.1,68.46 | 58.7,83.34 60.45,85.09 60.45,87.25 54.23,93.47 | 53.87,93.47 D1.1 | CTRST.E 51.82,25.4 51.82,23.5 49.78,21.46 49.78,18.54 51.69,16.64 51.69,16.89 53.34,16.89 56.26,13.97 | EX_PWR.2 30,104.27 C17.2 | 30.35,104.27 30.42,104.2 30.48,104.39 30.48,100.21 R10.2 30.35,99.7 TEMP-EX.3 33.4,93.6 C12.2 | 33.53,90.55 30.58,87.61 30.58,73.43 35.43,68.58 46.57,68.58 C9.+ | 20.98,90.14 19.56,91.57 19.56,96.39 22.48,99.31 22.48,101.35 24.64,103.5 | 21.97,7.62 23.24,8.89 43.81,8.89 47.62,12.7 49.78,12.7 51.56,14.48 BLED.E | v23.62,6.73 23.11,6.73 22.73,7.11 | 61.21,13.97 POWER_BY_USB_B.2
  Top 0.813: C10.+ C9.+ | RIGHT_PINS.3 RIGHT_PINS.4 | RIGHT_PINS.3 56.6,66.04 54.1,68.46 53.98,68.58 53.93,68.54 C10.+ | C10.+ 52.45,68.83 | RIGHT_PINS.3 59.94,66.04 61.98,64.01 61.98,18.67 64.39,16.26 64.39,13.97 63.12,12.7 POWER_BY_USB_B.2
  Bottom 0.406: 42.01,19.71 R4.2 | LCD_16_X_2.2 21.72,2.16
  Bottom 0.61: R5.2 R3.2 R4.2 | 42.01,19.71 44.83,16.89 BLED.E | 21.72,2.16 23.62,4.19 v23.62,6.73
GND  (via drill 0.5)
  Top 0.406: 57.4,86.36 57.28,86.36 56.13,85.22 DS18B20.5 56.13,86.23 55.63,86.74 v48.51,86.74 | 57.4,86.36 58.4,86.36 C11.1 | G1/BAT_EX.- 60.96,110.74 C1.2 | C16.1 37.23,99.21 35.31,97.28 35.31,96.77 TEMP-EX.1 | 57.4,86.36 53.49,90.27 R13.1 53.49,91.16 51.31,93.34 48.96,93.34 RTC.4 | C19.1 30.46,58.73 U$1.3_GND@1 30.61,58.88 30.61,60.83 29.08,62.36 24.89,62.36 23.09,60.56 U$1.6_GND@2 | 46.23,82.8 45.97,83.06 45.96,83.05 | U$1.GND@3 13.97,48.99 13.97,41.91 11.43,39.37 7.62,39.37 LEFT_PINS.23 | 9.91,115.82 9.65,115.82 6.86,113.03 6.73,113.03 6.35,112.65 6.35,111.51 6.48,111.38 1.78,111.38 1.02,110.62 1.02,97.54 3.17,95.38 | C3.1 47.24,77.85 47.5,77.6 | 35.58,85.75 U$3.GND1 U$3.GND2 36.8,83.84 37.47,83.19 37.47,78.49 C4.1 36.7,77.73 36.7,77.09 37.85,75.95 47.37,75.95 47.5,75.82 | C15.1 28.83,91.19 C12.1 | C2.1 45.21,83.95 47.24,81.92 | 47.24,81.92 47.5,81.66 47.5,75.82 | 46.23,73.66 47.5,74.93 47.5,75.82 | v48.5,82.94 48.27,82.94 47.24,81.92 | X4.3 32.33,4.77 | 54.38,4.73 X2.6 | 57.15,7.62 55.75,7.62 | 57.15,7.62 57.4,7.87 | 57.15,7.62 54.23,4.7 52.83,4.7 51.18,3.05 44.32,3.05 43.18,4.19 | LCD_16_X_2.LED_K 9.27,2.03 10.41,3.17 15.37,3.17 LCD_16_X_2.5 16.64,5.46 18.69,7.52 C18.1 18.69,7.47 LCD_16_X_2.1 23.11,4.45 24.26,3.3 30.91,3.3 X4.3 | LEFT_PINS.49 LEFT_PINS.50 | 43.18,4.19 43.18,4.57 X2.3 | X4.3 32.33,4.63 33.78,3.17 42.16,3.17 43.18,4.19
  Top 0.61: C5.1 27.18,99.8 27.18,96.77 U$4.GND 27.18,95.75 C15.1 | 46.48,72.9 46.48,73.91 47.5,74.93 47.5,77.6 47.5,81.51 45.96,83.05 C2.1 | RIGHT_PINS.49 54.38,4.73 | RIGHT_PINS.49 RIGHT_PINS.50 | RIGHT_PINS.49 55.75,7.62 BLED.A | C27.1 59.69,68.7 RIGHT_PINS.2
  Top 0.813: C7.- 47.24,58.12 C8.- 46.86,53.21 44.59,50.94 U$1.GND@4 | C10.- C9.- 46.4,72.94 46.35,72.9 46.48,72.9 | RIGHT_PINS.1 RIGHT_PINS.2 | 20.19,100.54 20.15,100.54 16.76,97.16 16.76,91.06 16.51,91.06 14.22,88.77 9.27,88.77 3.68,94.36 3.17,95.38 3.17,95.84 C13.-
  Top 1.016: C23.- C22.- 20.19,100.54 C14.- | 18.13,115.98 18.26,115.98 | 19.94,113.03 X3.1
  Top 1.27: 18.13,115.98 18.16,115.95 10.03,115.95 9.91,115.82 6.86,112.78 6.86,110.24 U$6.DC_GND | 18.26,115.98 19.94,114.3 19.94,113.03
  Bottom 0.406: BLED.A 51.56,11.43 52.96,12.83 52.96,19.18 CTRST.A | v48.51,86.74 48.64,86.61 48.64,85.22 48.63,83.05 v48.5,82.94 | TEMP-EX.1 34.04,95.25 29.84,95.25 28.83,96.27 U$4.GND | C26.1 36.83,11.3 C24.1 37.08,11.05 C25.1 41.27,8.13 43.31,6.1 43.31,4.75 X2.3
  Bottom 0.61: 24.26,114.81 32.97,114.81 X1.3 | X1.6 24.4,114.67 24.26,114.81 | C28.1 54.87,66.17 RIGHT_PINS.1 | U$6.DC_GND 6.48,110.61 C30.1 C29.1 | 24.26,114.81 21.72,114.81 X3.1
  other vias: 3.05,7.62 3.05,15.24 3.05,22.86 3.05,30.48 15.75,15.24 23.37,15.24 23.37,22.86 15.75,22.86 23.37,45.72 30.99,45.72 38.61,45.72 38.61,38.1 30.99,38.1 46.23,45.72 53.85,45.72 53.85,38.1 46.23,38.1 64.01,45.72 64.01,38.1 46.23,30.48 53.85,30.48 46.23,22.86 38.61,22.86 30.99,22.86 64.01,30.48 64.01,22.86 64.01,7.62 64.01,53.34 64.01,60.96 64.01,68.58 64.01,76.2 64.01,83.82 64.01,91.44 64.01,99.06 64.01,106.68 64.01,114.3 48.77,106.68 23.37,53.34 15.75,68.58 15.75,60.96 23.37,68.58 30.99,68.58 23.37,76.2 23.37,83.82 15.75,76.2 8.13,91.44 53.85,106.68 8.13,86.36 13.21,86.36 53.85,53.34 46.23,53.34 38.61,53.34
  pour Top: 66.42,-0.51 66.42,120.52 -0.38,120.4 -0.38,-0.38
  pour Bottom: 0,120.02 0,0 66.04,0 66.04,120.02
LCD_LED_A  (via drill 0.5)
  Top 0.406: BLED.S 47.62,14.35 43.18,9.91 18.03,9.91 16.51,8.38 v16.51,7.62
  Bottom 0.406: LCD_16_X_2.LED_A 9.65,4.45 11.18,5.97 11.94,5.97 13.59,7.62 16.26,7.62 16.38,7.75 v16.51,7.62
LCD_V0  (via drill 0.5)
  Top 0.406: CTRST.S 49.02,22.86 48.51,22.35 48.51,16.64 42.8,10.92 23.62,10.92 | 23.62,10.92 23.5,10.92 | v23.5,11.18 23.62,10.92
  Bottom 0.406: v23.5,11.18 18.8,6.48 18.8,4.83 LCD_16_X_2.3
N$1
  Top 0.406: U$3.NC 40.59,83.75 40.13,84.2 40.13,86.87 NC7.P$1
N$2
  Top 0.406: U$1.WRITE_PROTECTION_SWITCH 14.37,53.87 NC3.P$1
N$3
  Top 0.406: U$3.V0- 32.71,81.84 32.38,82.3 | 32.38,82.3 32.38,82.04 | NC8.P$1 32.38,82.3
N$4
  Top 0.406: U$1.GND@WP 14.08,55.87 NC4.P$1
N$6
  Top 0.406: U$1.NC@3 32.49,80.12 NC5.P$1
N$7
  Top 0.406: U$1.CARD_DETECTION NC6.P$1
N$8
  Top 0.406: U$1.8_NC@2 18.59,58.34 18.03,57.78 14.35,57.78 NC1.P$1
N$9
  Top 0.406: NC2.P$1 42.35,54.61 U$1.9_NC@1
N$11
  Top 0.406: RTC.7 45.72,101.83 R11.1
N$12
  Top 0.406: C1.1 63.91,109.88 63.63,109.6 60.71,109.6 59.44,108.34 G1/BAT_EX.+ 55.63,104.53 55.63,97.66 53.66,95.69 D1.2
N$13
  Top 0.406: C5.2 24.25,98.93 U$4.VDD 21.59,93.12 R2.1
N$15  (via drill 0.6)
  Top 0.406: v30.35,13.08 v34.92,13.08
  Bottom 0.406: R3.1 C24.2 35.82,13.97 v34.92,13.08 | X2.1 36.34,4.94 33.66,7.62 31.5,7.62 30.35,8.76 v30.35,13.08
N$16
  Bottom 0.406: R4.1 C25.2 42.16,13.85 43.31,12.7 43.31,8.25 X2.4
N$17
  Top 0.254: R6.2 2.39,89.41 LED1.C
N$18  (via drill 0.6)
  Top 0.406: v26.54,12.95 28.32,12.95 29.97,14.61 v30.48,14.61
  Bottom 0.406: 32.77,14.73 C26.2 | X4.1 25.33,5.26 26.54,6.48 v26.54,12.95 | 32.77,14.73 R5.1 | 32.77,14.73 32.64,14.61 v30.48,14.61
N$19
  Top 0.406: R12.1 R11.2
N$28
  Top 0.406: R13.2 50.04,90.81 48.64,92.2 47.24,92.2 46.99,92.46 RTC.3
PA1  (via drill 0.6)
  Top 0.406: 42.42,85.72 41.73,85.72 U$3.VO+ | C2.2 44.71,81.15 43.18,82.68 43.18,84.96 42.42,85.72 | 42.42,85.72 42.55,85.72 43.18,85.09 43.18,86.23 43.69,86.74 44.96,86.74 v47.5,84.2
  Bottom 0.406: v47.5,84.2 47.5,82.3 48.64,81.15 48.64,65.91 42.55,59.82 12.32,59.82 9.65,57.15 7.62,57.15 LEFT_PINS.11
PA2
  Top 0.406: U$4.VO 24.15,96.24 24.28,96.24 24.38,96.14 C15.2 24.38,90.04 22.61,88.27 19.81,88.27 12.06,80.52 12.06,77.85 13.21,76.71 13.21,73.03 11.94,71.75 11.94,60.2 10.41,58.67 10.41,55.24 8.89,53.72 LEFT_PINS.14
  Bottom 0.406: 24.26,97.03 24.26,96.39 U$4.VO
  Bottom 0.61: X1.5 27.9,102.19 24.26,98.55 24.26,97.03
PA3
  Bottom 0.406: LEFT_PINS.13 6.22,53.34 4.7,51.82 4.7,42.67 5.46,41.91 9.78,41.91 27.56,24.13 27.56,6 X4.2
  Bottom 0.61: C31.2 6.23,53.46 LEFT_PINS.13
PA9
  Top 0.813: RIGHT_PINS.44 POWER_BY_USB_B.1
PA15  (via drill 0.5)
  Top 0.406: TEMP-EX.2 32.89,99.44 R10.1 | R9.1 56.37,78.23 DS18B20.4 56.13,77.22 56.01,77.09 | TEMP-EX.2 32.77,96.77 | 56.01,77.09 55.37,76.45 51.82,76.45 51.18,77.09 51.18,82.3 45.09,88.39 41.15,88.39 TEMP-EX.2 | v57.66,76.45 56.26,77.85 56.01,77.09 | 33.28,104.65 C17.1
  Top 0.61: R10.1 33.28,104.65 33.28,106.05 38.73,111.51 38.73,112.54 X1.2 | C20.1 58.52,78.13 R9.1
  Bottom 0.406: RIGHT_PINS.40 60.2,20.32 61.59,21.72 61.59,72.39 v57.66,76.45
PB0
  Top 0.406: C33.2 9.02,43.05 LEFT_PINS.22
  Bottom 0.406: LEFT_PINS.22 9.91,43.18 28.45,24.64 28.45,7.49 30.35,5.59 30.35,4.32 32.38,2.16 38.1,2.16 39.88,3.94 39.88,4.68 X2.2
PB6  (via drill 0.5)
  Top 0.406: R8.1 47.88,102.23 46.99,101.35 RTC.6 46.99,98.04 47.62,97.41 49.15,97.41 v49.15,97.16
  Bottom 0.406: v49.15,97.16 49.28,96.9 49.66,96.52 49.66,51.56 55.88,45.34 55.88,42.04 RIGHT_PINS.23
PB9  (via drill 0.5)
  Top 0.406: RTC.5 48.45,99.44 R7.1 50.92,97.66 v50.67,97.16
  Bottom 0.406: 50.67,97.28 v50.67,97.16 50.67,52.07 55.75,46.99 58.55,46.99 RIGHT_PINS.20
PB12  (via drill 0.5)
  Top 0.406: U$1.1_NCS 35.59,57.69 34.16,56.26 34.16,43.18 v11.81,20.83
  Bottom 0.406: v11.81,20.83 11.81,20.95 11.94,21.08 11.94,23.62 10.29,25.27 9.02,25.27 LEFT_PINS.36
PB13  (via drill 0.5)
  Top 0.406: U$1.5_CLK(SCLK) 25.59,37.53 v10.79,22.73
  Bottom 0.406: LEFT_PINS.37 6.73,22.86 8,21.59 9.65,21.59 v10.79,22.73
PB14
  Top 0.406: U$1.7_DOUT(MISO) 20.59,58.02 24.64,53.98 24.64,37.97 9.53,22.86 LEFT_PINS.38
PB15
  Top 0.406: U$1.2_DIN(MOSI) 33.09,43.63 11.05,21.59 7.87,21.59 6.6,20.32 LEFT_PINS.39
PC1
  Top 0.406: LEFT_PINS.7 6.35,61.21 4.83,62.74 4.83,69.22 9.91,74.3 SW1.1
PC2
  Top 0.406: LEFT_PINS.10 8.89,58.67 10.92,60.71 10.92,72.39 12.19,73.66 12.19,75.82 11.18,76.83 SW1.2
PC4  (via drill 0.6)
  Top 0.406: v30.99,6.6 48.46,6.6 X2.5
  Bottom 0.406: LEFT_PINS.20 8.89,45.59 29.34,25.15 29.34,8.26 v30.99,6.6
  Bottom 0.61: C32.2 9.02,45.85 LEFT_PINS.20
PD1  (via drill 0.5)
  Top 0.406: v25.15,11.94 42.29,11.94 47.37,17.02 47.37,23.88 51.44,27.94 RIGHT_PINS.33
  Bottom 0.406: 24.89,12.06 v25.15,11.94 25.15,11.3 20.45,6.6 20.45,3.68 19.18,2.41 LCD_16_X_2.4
PD2  (via drill 0.6)
  Top 0.406: LCD_16_X_2.6 17.91,3.17 22.73,3.17 23.88,2.03 51.94,2.03 v52.58,2.54
  Bottom 0.406: v52.58,2.54 52.58,3.3 51.94,3.94 51.94,10.03 54.1,12.19 54.1,24.51 56.26,26.67 58.55,26.67 RIGHT_PINS.34
PD8  (via drill 0.5)
  Top 0.406: LEFT_PINS.40 10.67,20.32 13.97,17.02 13.97,6.48 v14.1,6.35
  Bottom 0.406: LCD_16_X_2.14 11.68,2.41 12.95,3.68 12.95,5.21 v14.1,6.35
PD9
  Top 0.406: LCD_16_X_2.11 13.97,4.45 12.95,5.46 12.95,15.75 9.65,19.05 7.62,19.05 LEFT_PINS.41
PD10
  Top 0.406: LEFT_PINS.42 8.89,17.53 11.94,14.48 11.94,4.7 LCD_16_X_2.13
PD11  (via drill 0.5)
  Top 0.406: LEFT_PINS.43 7.62,13.97 10.54,13.97 10.92,13.59 v10.92,8.76 | v15.49,6.48 15.49,6.73 15.11,7.37 v15.11,8.76
  Bottom 0.406: LCD_16_X_2.12 14.22,2.41 15.49,3.68 v15.49,6.48 | 11.05,8.89 v10.92,8.76 v15.11,8.76
PE7
  Top 0.406: LEFT_PINS.25 6.1,38.1 3.68,40.51 3.68,69.6 8.13,74.04 8.13,77.98 9.53,79.38 SW1.3
PE9
  Top 0.406: LEFT_PINS.27 6.22,35.56 2.67,39.12 2.67,70.1 7.11,74.55 7.11,79.76 9.27,81.92 SW1.4
PLUS_5
  Top 1.016: C14.+ 17.91,104.94 17.91,100.84 17.14,100.08 15.49,100.08 12.57,97.16 C22.+ C23.+
  Top 1.27: EX_PWR.1 20.61,106.81 C14.+
  Bottom 0.61: C30.2 3.68,110.87 U$6.DC_OUT
  Bottom 1.27: U$6.DC_OUT 4.57,109.09 6.1,107.57 6.99,106.81 EX_PWR.1
VDD  (2 unrouted)

### Text on the board
tPlace: (+) (G) | 1WIRE | * | * | * | RTC | PCF88583 | TEMP. INT. | HIH530 | HUMIDITY | PRESSURE | * | PS100TQ | * | NEAR SPACE | METEO CONTROLLER | R.G. 2013 V1.0
bPlace: * | *
tOrigins: HUM | TEMP | -G1- | -A1- | -V1- | -GT- | -IT- | -VT- | [V2] | [A2] | [G2] | [V3] | [A3] | [G3] | [V4] | [A4] | [G4]